# Altium schematic sheet Main_board.SchDoc
size A1
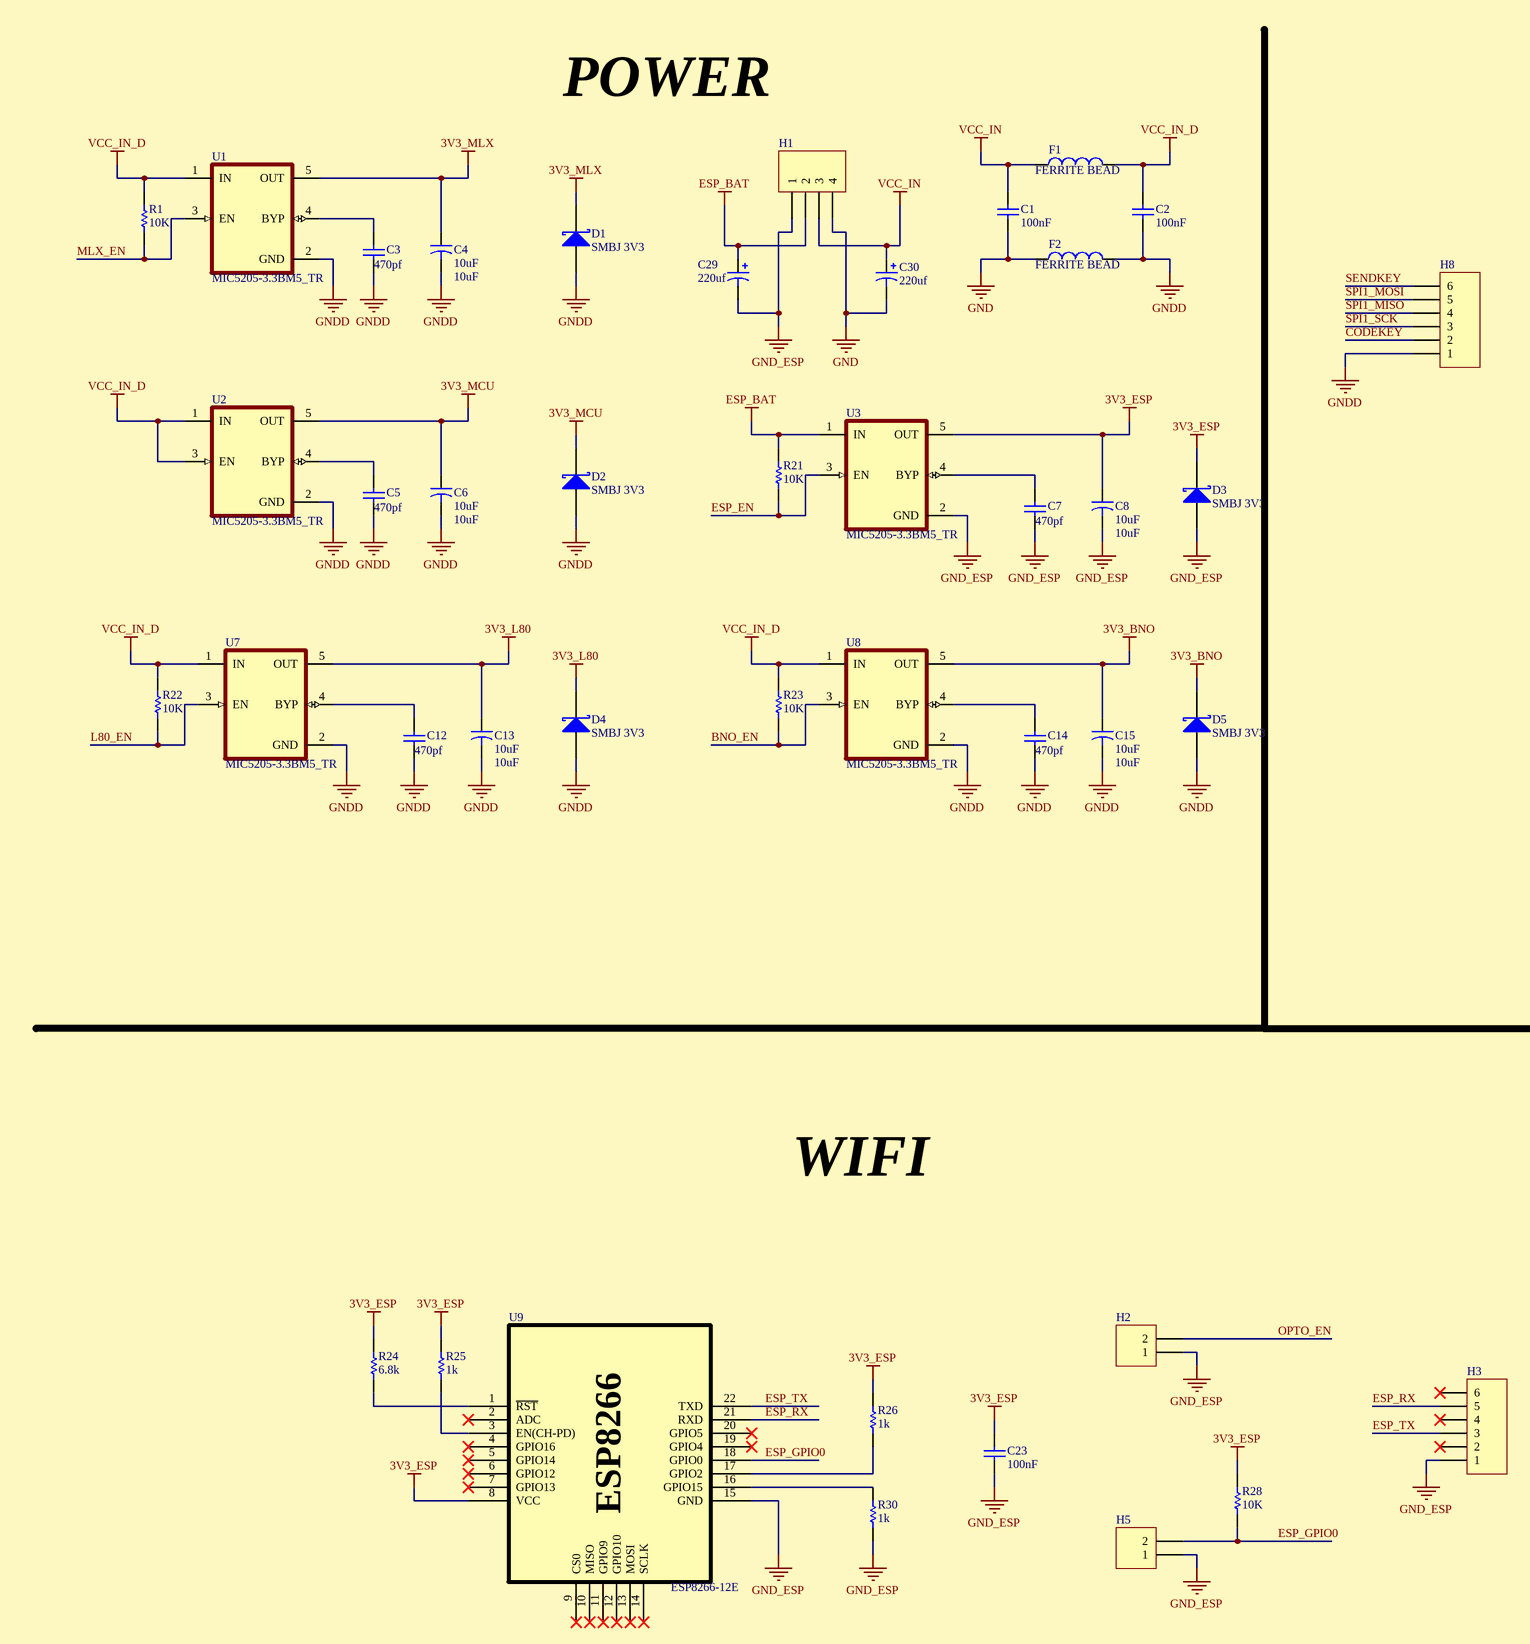
[diagram p0: Main_board.SchDoc, top left]
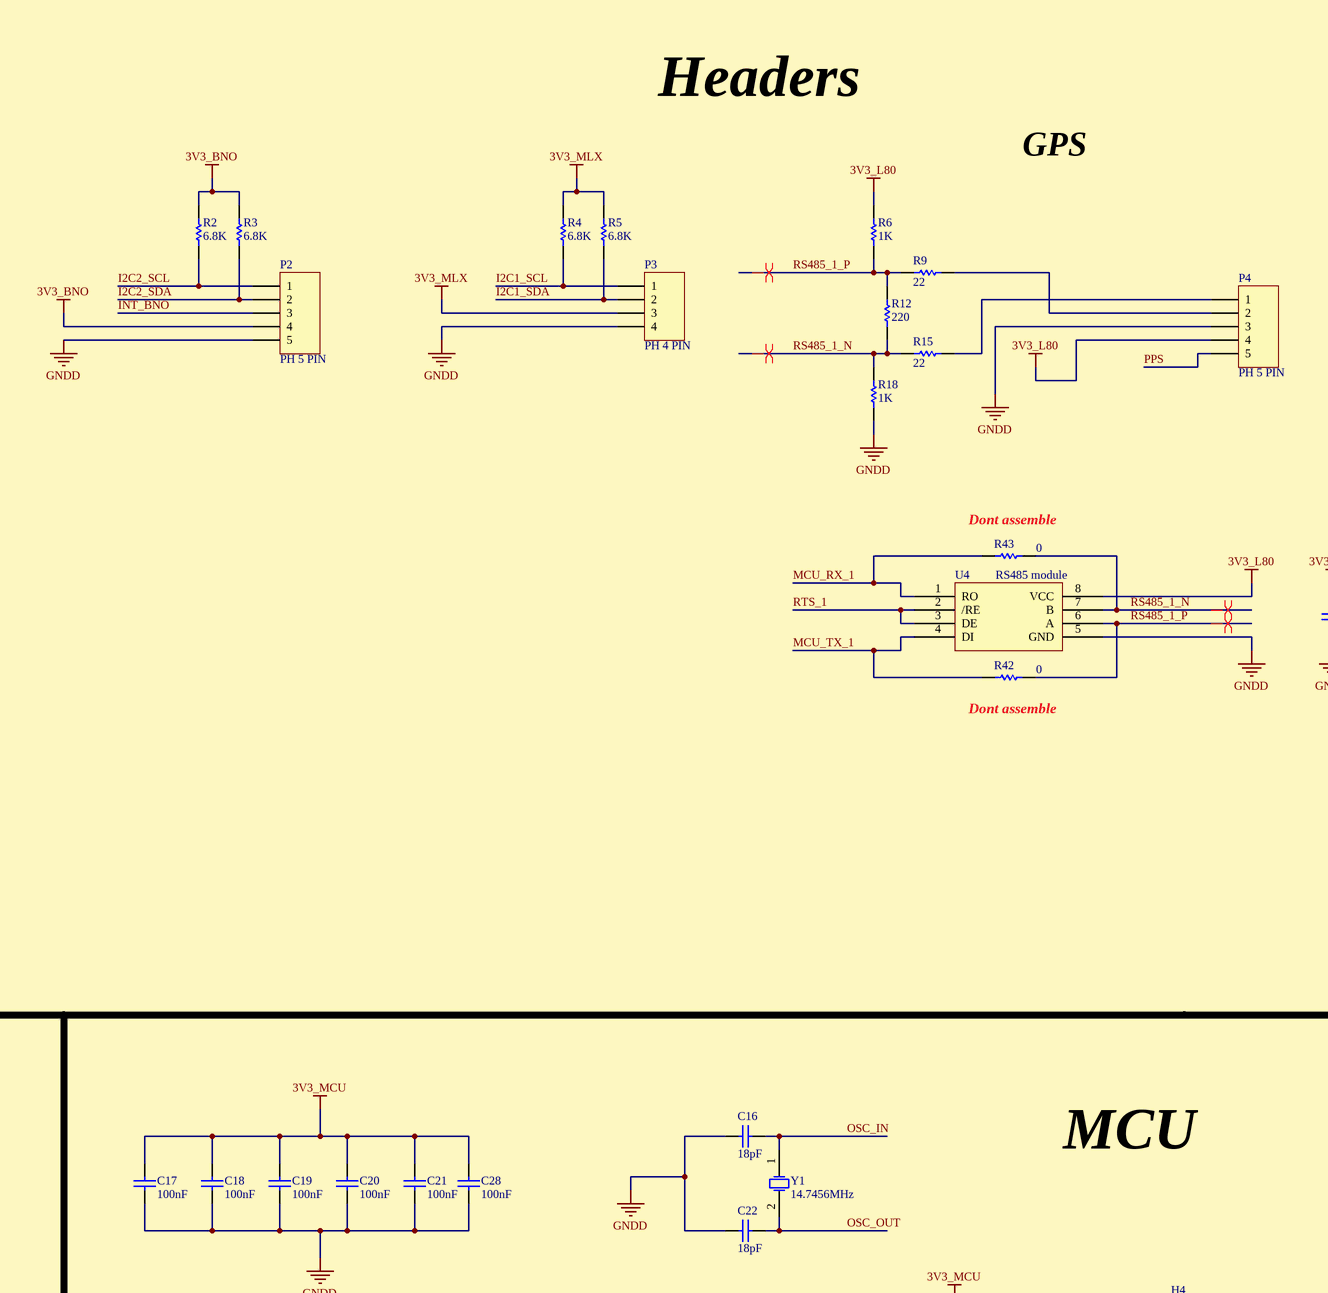
[diagram p1: Main_board.SchDoc, top middle]
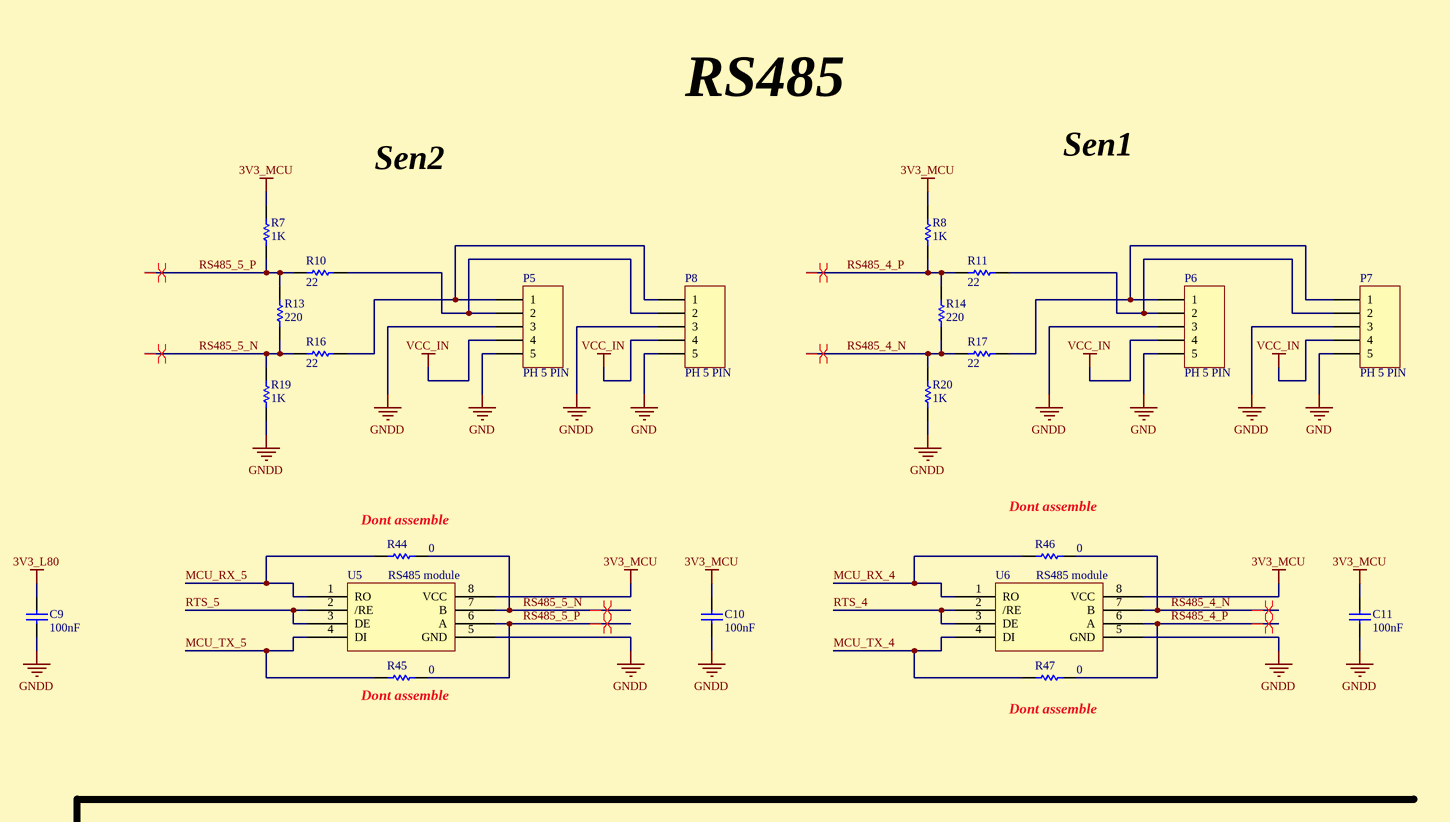
[diagram p2: Main_board.SchDoc, top right]
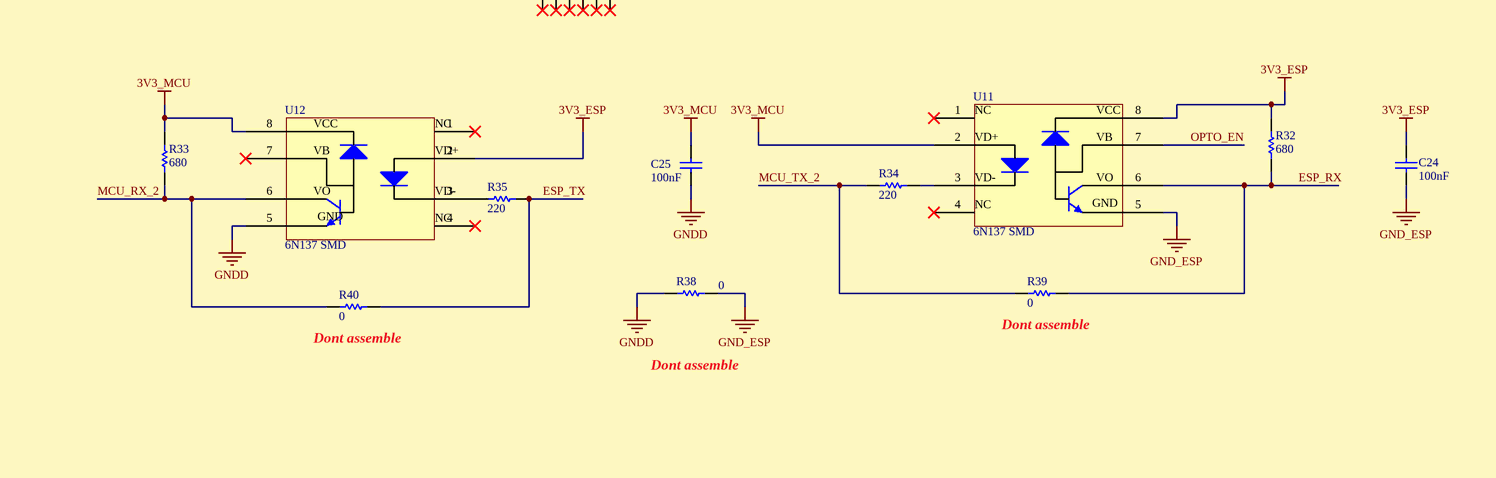
[diagram p3: Main_board.SchDoc, bottom left]
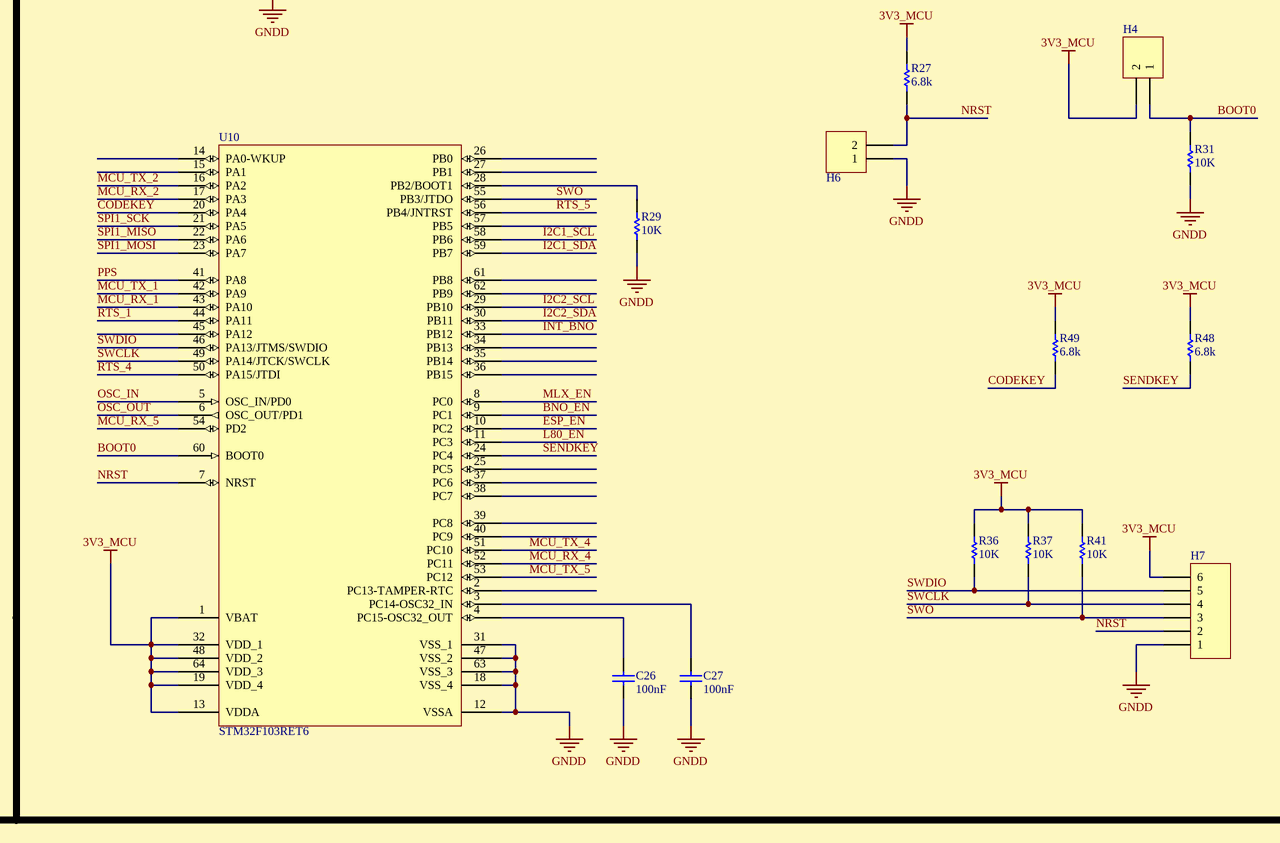
[diagram p4: Main_board.SchDoc, bottom middle]
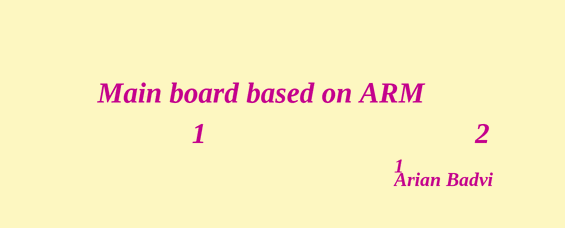
[diagram p5: Main_board.SchDoc, bottom right]

## Parts
C1  100nF  [C0805]
C2  100nF  [C0805]
C3  470pf  [C0805]
C4  10uF  [CAP_SMD_A]
C5  470pf  [C0805]
C6  10uF  [CAP_SMD_A]
C7  470pf  [C0805]
C8  10uF  [CAP_SMD_A]
C9  100nF  [C0805]
C10  100nF  [C0805]
C11  100nF  [C0805]
C12  470pf  [C0805]
C13  10uF  [CAP_SMD_A]
C14  470pf  [C0805]
C15  10uF  [CAP_SMD_A]
C16  18pF  [C0805]
C17  100nF  [C0805]
C18  100nF  [C0805]
C19  100nF  [C0805]
C20  100nF  [C0805]
C21  100nF  [C0805]
C22  18pF  [C0805]
C23  100nF  [C0805]
C24  100nF  [C0805]
C25  100nF  [C0805]
C26  100nF  [C0805]
C27  100nF  [C0805]
C28  100nF  [C0805]
C29  220uf  [C_CYL_SMD2]
C30  220uf  [C_CYL_SMD2]
D1  SMBJ 3V3  [TVS]
D2  SMBJ 3V3  [TVS]
D3  SMBJ 3V3  [TVS]
D4  SMBJ 3V3  [TVS]
D5  SMBJ 3V3  [TVS]
F1  FERRITE BEAD  [0805]
F2  FERRITE BEAD  [0805]
H1  XH 4pin  [XH_4]  (value not drawn)
H2  Pin Header, 1.27  [H_1.27]  (value not drawn)
H3  PB 6pin SMD  [PB_6_SMD]  (value not drawn)
H4  Pin Header, 1.27  [H_1.27]  (value not drawn)
H5  Pin Header, 1.27  [H_1.27]  (value not drawn)
H6  Pin Header, 1.27  [H_1.27]  (value not drawn)
H7  PB 6pin SMD  [PB_6_SMD]  (value not drawn)
H8  PB 6pin SMD  [PB_6_SMD]  (value not drawn)
P2  PH 5 PIN  [PH_5]
P3  PH 4 PIN  [PH_4]
P4  PH 5 PIN  [PH_5]
P5  PH 5 PIN  [PH_5]
P6  PH 5 PIN  [PH_5]
P7  PH 5 PIN  [PH_5]
P8  PH 5 PIN  [PH_5]
R1  10K  [0805]
R2  6.8K  [0805]
R3  6.8K  [0805]
R4  6.8K  [0805]
R5  6.8K  [0805]
R6  1K  [0805]
R7  1K  [0805]
R8  1K  [0805]
R9  22  [0805]
R10  22  [0805]
R11  22  [0805]
R12  220  [0805]
R13  220  [0805]
R14  220  [0805]
R15  22  [0805]
R16  22  [0805]
R17  22  [0805]
R18  1K  [0805]
R19  1K  [0805]
R20  1K  [0805]
R21  10K  [0805]
R22  10K  [0805]
R23  10K  [0805]
R24  6.8k  [0805]
R25  1k  [0805]
R26  1k  [0805]
R27  6.8k  [0805]
R28  10K  [0805]
R29  10K  [0805]
R30  1k  [0805]
R31  10K  [0805]
R32  680  [0805]
R33  680  [0805]
R34  220  [0805]
R35  220  [0805]
R36  10K  [0805]
R37  10K  [0805]
R38  0  [0603]
R39  0  [0603]
R40  0  [0603]
R41  10K  [0805]
R42  0  [0603]
R43  0  [0603]
R44  0  [0603]
R45  0  [0603]
R46  0  [0603]
R47  0  [0603]
R48  6.8k  [0805]
R49  6.8k  [0805]
U1  MIC5205-3.3BM5_TR  [SOT23_5]
U2  MIC5205-3.3BM5_TR  [SOT23_5]
U3  MIC5205-3.3BM5_TR  [SOT23_5]
U4  RS485 module  [SOP8]
U5  RS485 module  [SOP8]
U6  RS485 module  [SOP8]
U7  MIC5205-3.3BM5_TR  [SOT23_5]
U8  MIC5205-3.3BM5_TR  [SOT23_5]
U9  ESP8266-12E  [ESP8266_ESP12E]
U10  STM32F103RET6  [LQFP64]
U11  6N137 SMD  [DIP_8SMD]
U12  6N137 SMD  [DIP_8SMD]
Y1  14.7456MHz  [XTAL_SMD]

## Nets
3V3_BNO: C15.1 D5.1(K) P2.4 R2.2 R3.2 U8.5(OUT)
3V3_ESP: C8.1 C23.2 C24.2 D3.1(K) R24.1 R25.2 R26.2 R28.2 R32.2 U3.5(OUT) U9.8(VCC) U11.8 U12.2
3V3_L80: C9.2 C13.1 D4.1(K) P4.4 R6.2 U4.8(VCC) U7.5(OUT)
3V3_MCU: C6.1 C10.2 C11.2 C17.2 C18.2 C19.2 C20.2 C21.2 C25.2 C28.2 D2.1(K) H4.2 H7.6 R7.2 R8.2 R27.1 R33.1 R36.1 R37.1 R41.1 R48.1 R49.1 U2.5(OUT) U5.8(VCC) U6.8(VCC) U10.1(VBAT) U10.13(VDDA) U10.19(VDD_4) U10.32(VDD_1) U10.48(VDD_2) U10.64(VDD_3) U11.2 U12.8
3V3_MLX: C4.1 D1.1(K) P3.3 R4.2 R5.2 U1.5(OUT)
ESP_BAT: C29.1 H1.2 R21.1 U3.1(IN)
GND: C1.1 C30.2 F2.1 H1.4 P5.5 P6.5 P7.5 P8.5
GND_ESP: C7.1 C8.2 C23.1 C24.1 C29.2 D3.2(A) H1.1 H2.1 H3.1 H5.1 R30.2 R38.2 U3.2(GND) U9.15(GND) U11.5(GND)
GNDD: C2.1 C3.1 C4.2 C5.1 C6.2 C9.1 C10.1 C11.1 C12.1 C13.2 C14.1 C15.2 C16.1 C17.1 C18.1 C19.1 C20.1 C21.1 C22.1 C25.1 C26.1 C27.1 C28.1 D1.2(A) D2.2(A) D4.2(A) D5.2(A) F2.2 H6.1 H7.1 H8.1 P2.5 P3.4 P4.3 P5.3 P6.3 P7.3 P8.3 R18.1 R19.1 R20.1 R29.2 R31.2 R38.1 U1.2(GND) U2.2(GND) U4.5(GND) U5.5(GND) U6.5(GND) U7.2(GND) U8.2(GND) U10.12(VSSA) U10.18(VSS_4) U10.31(VSS_1) U10.47(VSS_2) U10.63(VSS_3) U12.5(GND)
VCC_IN: C1.2 C30.1 F1.1 H1.3 P5.4 P6.4 P7.4 P8.4
VCC_IN_D: C2.2 F1.2 R1.1 R22.1 R23.1 U1.1(IN) U2.1(IN) U2.3(EN) U7.1(IN) U8.1(IN)
BNO_EN: R23.2 U8.3(EN) U10.9(PC1)
BOOT0: H4.1 R31.1 U10.60(BOOT0)
CODEKEY: H8.2 R49.2 U10.20(PA4)
ESP_EN: R21.2 U3.3(EN) U10.10(PC2)
ESP_GPIO0: H5.2 R28.1 U9.18(GPIO0)
ESP_RX: H3.5 R32.1 R39.2 U9.21(RXD) U11.6
ESP_TX: H3.3 R35.2 R40.2 U9.22(TXD)
I2C1_SCL: P3.1 R4.1 U10.58(PB6)
I2C1_SDA: P3.2 R5.1 U10.59(PB7)
I2C2_SCL: P2.1 R2.1 U10.29(PB10)
I2C2_SDA: P2.2 R3.1 U10.30(PB11)
INT_BNO: P2.3 U10.33(PB12)
L80_EN: R22.2 U7.3(EN) U10.11(PC3)
MCU_RX_1: R43.1 U4.1(RO) U10.43(PA10)
MCU_RX_2: R33.2 R40.1 U10.17(PA3) U12.6
MCU_RX_4: R46.1 U6.1(RO) U10.52(PC11)
MCU_RX_5: R44.1 U5.1(RO) U10.54(PD2)
MCU_TX_1: R42.1 U4.4(DI) U10.42(PA9)
MCU_TX_2: R34.1 R39.1 U10.16(PA2)
MCU_TX_4: R47.1 U6.4(DI) U10.51(PC10)
MCU_TX_5: R45.1 U5.4(DI) U10.53(PC12)
MLX_EN: R1.2 U1.3(EN) U10.8(PC0)
NRST: H6.2 H7.2 R27.2 U10.7(NRST)
OPTO_EN: H2.2 U11.7
OSC_IN: C16.2 U10.5(OSC_IN/PD0) Y1.1(OSC1)
OSC_OUT: C22.2 U10.6(OSC_OUT/PD1) Y1.2(OSC2)
PPS: P4.5 U10.41(PA8)
RS485_1_N: R12.2 R15.1 R18.2 R43.2 U4.7(B)
RS485_1_P: R6.1 R9.1 R12.1 R42.2 U4.6(A)
RS485_4_N: R14.2 R17.1 R20.2 R46.2 U6.7(B)
RS485_4_P: R8.1 R11.1 R14.1 R47.2 U6.6(A)
RS485_5_N: R13.2 R16.1 R19.2 R44.2 U5.7(B)
RS485_5_P: R7.1 R10.1 R13.1 R45.2 U5.6(A)
RTS_1: U4.2(/RE) U4.3(DE) U10.44(PA11)
RTS_4: U6.2(/RE) U6.3(DE) U10.50(PA15/JTDI)
RTS_5: U5.2(/RE) U5.3(DE) U10.56(PB4/JNTRST)
SENDKEY: H8.6 R48.2 U10.24(PC4)
SPI1_MISO: H8.4 U10.22(PA6)
SPI1_MOSI: H8.5 U10.23(PA7)
SPI1_SCK: H8.3 U10.21(PA5)
SWCLK: H7.4 R37.2 U10.49(PA14/JTCK/SWCLK)
SWDIO: H7.5 R36.2 U10.46(PA13/JTMS/SWDIO)
SWO: H7.3 R41.2 U10.55(PB3/JTDO)
NetC3_2: C3.2 U1.4(BYP)
NetC5_2: C5.2 U2.4(BYP)
NetC7_2: C7.2 U3.4(BYP)
NetC12_2: C12.2 U7.4(BYP)
NetC14_2: C14.2 U8.4(BYP)
NetC26_2: C26.2 U10.4(PC15-OSC32_OUT)
NetC27_2: C27.2 U10.3(PC14-OSC32_IN)
NetP4_1: P4.1 R15.2
NetP4_2: P4.2 R9.2
NetP5_1: P5.1 P8.1 R16.2
NetP5_2: P5.2 P8.2 R10.2
NetP6_1: P6.1 P7.1 R17.2
NetP6_2: P6.2 P7.2 R11.2
NetR24_2: R24.2 U9.1(~{RST})
NetR25_1: R25.1 U9.3(EN(CH-PD))
NetR26_1: R26.1 U9.17(GPIO2)
NetR29_1: R29.1 U10.28(PB2/BOOT1)
NetR30_1: R30.1 U9.16(GPIO15)
NetR34_2: R34.2 U11.3
NetR35_1: R35.1 U12.3

Not connected (* = marked no-connect by the designer): H3 2* 4* 6*; U9 2(ADC)* 4(GPIO16)* 5(GPIO14)* 6(GPIO12)* 7(GPIO13)* 9(CS0)* 10(MISO)* 11(GPIO9)* 12(GPIO10)* 13(MOSI)* 14(SCLK)* 19(GPIO4)* 20(GPIO5)*; U10 2(PC13-TAMPER-RTC) 14(PA0-WKUP) 15(PA1) 25(PC5) 26(PB0) 27(PB1) 34(PB13) 35(PB14) 36(PB15) 37(PC6) 38(PC7) 39(PC8) 40(PC9) 45(PA12) 57(PB5) 61(PB8) 62(PB9); U11 1* 4*; U12 1* 4* 7*

## Layout directives
differential pair: RS485_1_N, RS485_1_P, RS485_4_N, RS485_4_P, RS485_5_N, RS485_5_P

## Notes on the sheet
- POWER
- Headers
- RS485
- GPS
- Sen2
- Sen1
- (near R46) Dont assemble
- (near R43) Dont assemble
- (near R44) Dont assemble
- (near R42) Dont assemble
- (near R45) Dont assemble
- (near R47) Dont assemble
- WIFI
- MCU
- (near R39) Dont assemble
- (near R40) Dont assemble
- Dont assemble
- Main board based on ARM
- 1
- Arian Badvi
- 2
- (in symbol 6N137) VCC; NC; VB; VD+; VO; VD-

## Library data of the parts
C1 C2 C9-C11 C16-C24 C26-C28 = Cap: Capacitor; Published: 8-Jun-2000; LatestRevisionDate: 17-Jul-2002; LatestRevisionNote: Re-released for DXP Platform.; PackageReference: RAD-0.3; Publisher: Altium Limited
  C1 C2 C9-C11 C17-C21 C23 C24 C26-C28: Value: 100nF
  C16 C22: Value: 18pF
C3 C5 C7 C12 C14 C25 = Cap: Capacitor, 1206; Published: 8-Jun-2000; LatestRevisionDate: 17-Jul-2002; LatestRevisionNote: Re-released for DXP Platform.; PackageReference: RAD-0.3; Publisher: Altium Limited
  C3 C5 C7 C12 C14: PackageDescription: Radial Cap, Thru-Hole; 2 Leads; 0.3 in Pin Spacing; Value: 470pf
  C25: Value: 100nF
C4 C6 C8 C13 C15 = Cap2: Capacitor, 10uf; Published: 23-Sep-2002; PackageReference: CAPR5-4X5; Publisher: Altium Limited; Value: 10uF
C29 C30 = Cap Pol: pol cap, Ele; Published: 8-Jun-2000; LatestRevisionDate: 17-Jul-2002; LatestRevisionNote: Re-released for DXP Platform.; PackageReference: POLAR0.8; Publisher: Altium Limited; PackageDescription: Polarized Capacitor; 2 Leads; Value: 220uf
D1-D5 = Diode 18TQ045: TVS; Note: Terminal 2 is the TAB and is electrically connected to the cathode; Published: 8-Jun-2000; LatestRevisionDate: 17-Jul-2002; LatestRevisionNote: Re-released for DXP Platform.; DatasheetVersion: Dec-1997; PackageVersion: Feb-1998; PackageReference: TO-220AC; Publisher: Altium Limited; ComponentLink1Description: Manufacturer Link; ComponentLink1URL: http://www.irf.com/; ComponentLink2Description: Datasheet; ComponentLink2URL: http://www.irf.com/product-info/datasheets/data/18tq.pdf
F1 F2 = Inductor: Code_IEC: 1005; Published: 8-Jun-2000; LatestRevisionDate: 29-May-2009; LatestRevisionNote: IPC-7351 Footprint Added.; PackageReference: 0402-A; Publisher: Altium Limited; PackageDescription: Chip Inductor; Code_JEITA: 0402
H1 = Header 4: White Connector 4pin; LatestRevisionDate: 17-Jul-2002; LatestRevisionNote: Re-released for DXP Platform.; Publisher: Altium Limited
H2 H4-H6 = Header 2: Header, 2-Pin, 1.27mm; LatestRevisionDate: 17-Jul-2002; LatestRevisionNote: Re-released for DXP Platform.; Publisher: Altium Limited
H3 H7 H8 = Header 6: White SMD Connector 6pin; LatestRevisionDate: 17-Jul-2002; LatestRevisionNote: Re-released for DXP Platform.; Publisher: Altium Limited
P2 P4-P8 = Header 5: Header, 5-Pin; LatestRevisionDate: 17-Jul-2002; LatestRevisionNote: Re-released for DXP Platform.; Publisher: Altium Limited
P3 = Header 4: Header, 4-Pin; LatestRevisionDate: 17-Jul-2002; LatestRevisionNote: Re-released for DXP Platform.; Publisher: Altium Limited
R1 R21-R23 R32 R34 R35 R38-R40 = Resistor: General Resistor; Published: 8-Jun-2000; LatestRevisionDate: 17-Jul-2002; LatestRevisionNote: Re-released for DXP Platform.; PackageReference: AXIAL-0.3; Publisher: Altium Limited; PackageDescription: Axial Device, Thru-Hole; 2 Leads; 0.3 in Pin Spacing
  R1 R21-R23: Value: 10K
  R32: Value: 680
  R34 R35: Value: 220
  R38-R40: Value: 0
R2-R20 R25 R26 R28 R30 = Res1: Resistor; Published: 8-Jun-2000; LatestRevisionDate: 17-Jul-2002; LatestRevisionNote: Re-released for DXP Platform.; PackageReference: AXIAL-0.3; Publisher: Altium Limited
  R2-R5: Value: 6.8K
  R6-R8 R18-R20: Value: 1K
  R9-R11 R15-R17: Value: 22
  R12-R14: Value: 220
  R25 R26 R30: Value: 1k
  R28: Value: 10K
R24 R27 R33 R48 R49 = Res1: Resistor, 6.8k; Published: 8-Jun-2000; LatestRevisionDate: 17-Jul-2002; LatestRevisionNote: Re-released for DXP Platform.; PackageReference: AXIAL-0.3; Publisher: Altium Limited
  R24 R27 R48 R49: Value: 6.8k
  R33: Value: 680
R29 R31 = Res1: Resistor, 10k; Published: 8-Jun-2000; LatestRevisionDate: 17-Jul-2002; LatestRevisionNote: Re-released for DXP Platform.; PackageReference: AXIAL-0.3; Publisher: Altium Limited; Value: 10K
R36 R37 R41-R47 = Res1: Resistor, 10K; Published: 8-Jun-2000; LatestRevisionDate: 17-Jul-2002; LatestRevisionNote: Re-released for DXP Platform.; PackageReference: AXIAL-0.3; Publisher: Altium Limited
  R36 R37 R41: Value: 10K
  R42-R47: Value: 0
U1-U3 U7 U8 = MIC5205-3.3BM5_TR: Linear Voltage Regulator IC 1 Output 150mA SOT-23-5; MP: MIC5205-3.3BM5 TR; MF: Micrel; Package: SOT-23-5 Micrel; Value: *; Availability: Unavailable; Price: None; SnapEDA_Link: https://www.snapeda.com/parts/MIC5205-3.3BM5%20TR/Micrel/view-part/225112/?ref=snap
U4-U6 = rs485
U9 = ESP8266
U10 = STM32F103R8T6: STM32 ARM-based 32-bit MCU with 64 Kbytes Flash, 64-pin LQFP, Industrial Temperature; Published: 30-May-2008; DatasheetVersion: rev6, Mar-2008; PackageVersion: Mar-2008; PackageReference: LQFP64; Publisher: Altium Limited; PackageDescription: 64-Pin Low-Profile Quad Flat Pack, 10 x 10 mm Body, 0.5 mm Pitch (LQFP64); ComponentLink1Description: Manufacturer Link; ComponentLink1URL: www.st.com/stm32; ComponentLink2Description: Datasheet; ComponentLink2URL: http://www.st.com/stonline/products/literature/ds/13587.pdf
U11 U12 = 6N137
Y1 = XTAL: Crystal Oscillator, 14.7456KHz; Published: 8-Jun-2000; LatestRevisionDate: 17-Jul-2002; LatestRevisionNote: Re-released for DXP Platform.; PackageReference: R38; Publisher: Altium Limited